# Altium schematic sheet UKU100.SchDoc
size A3
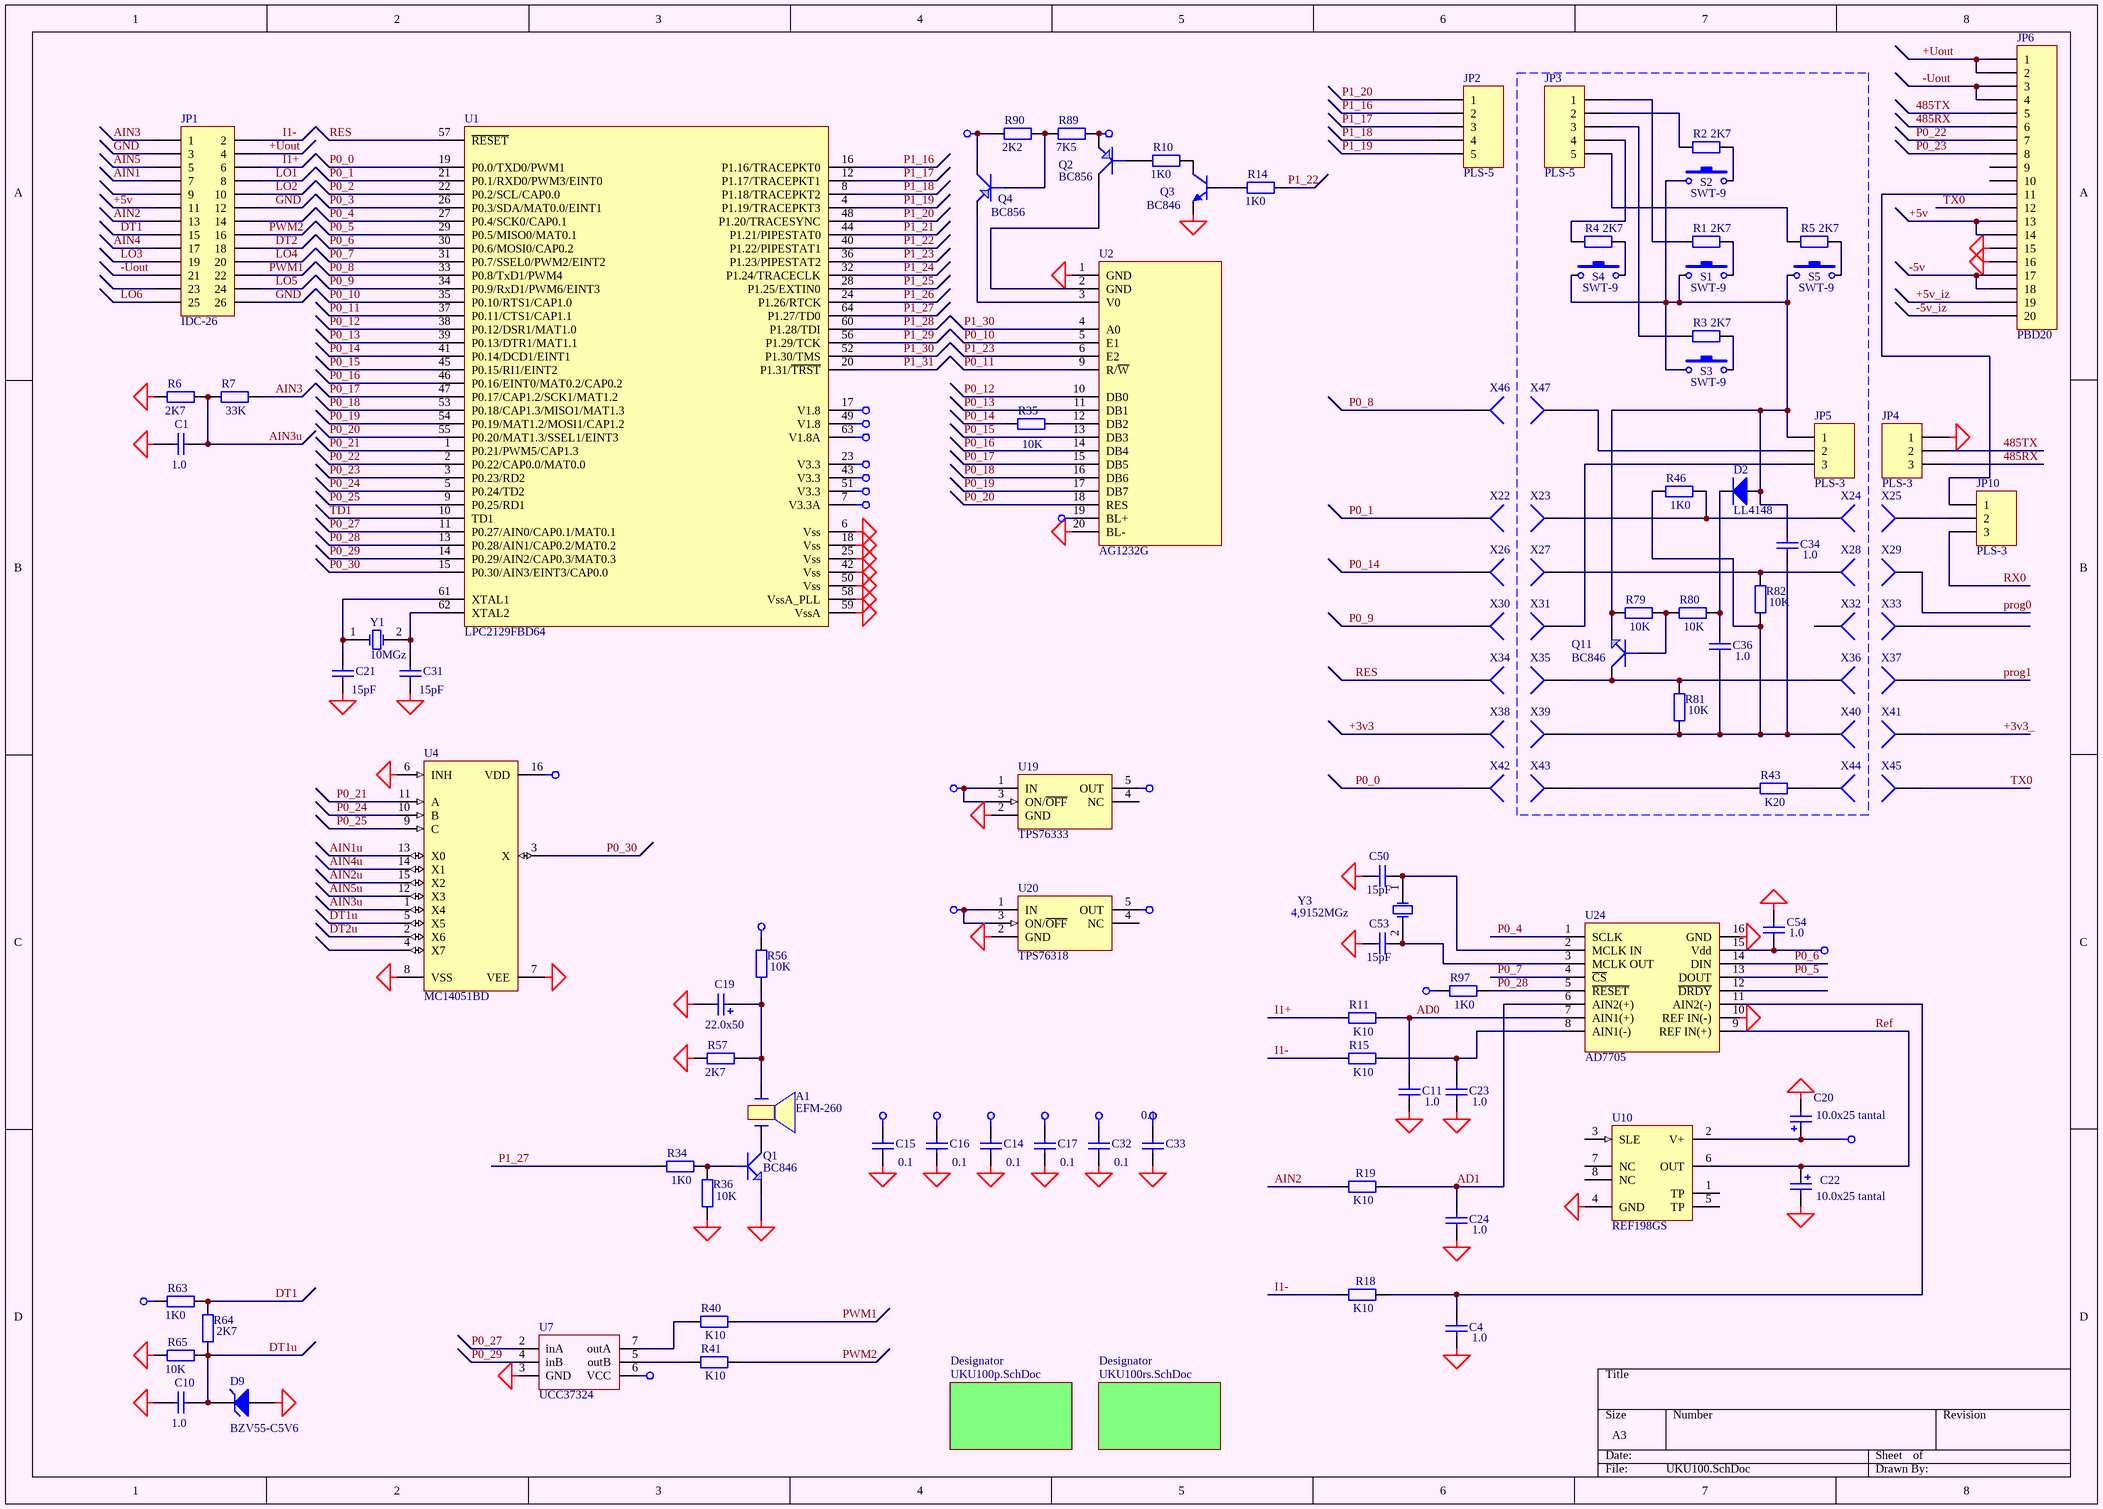
[diagram p0: UKU100.SchDoc]

## Parts
A1  EFM-260  [Pjezo15]
C1  1.0  [C3216-1206]
C4  1.0  [_1206]
C10  1.0  [C3216-1206]
C11  1.0  [C3216-1206]
C14  0.1  [C3216-1206]
C15  0.1  [C3216-1206]
C16  0.1  [C3216-1206]
C17  0.1  [C3216-1206]
C19  22.0x50  [el3]
C20  10.0x25 tantal  [cap_el_6_3]
C21  15pF  [C3216-1206]
C22  10.0x25 tantal  [cap_el_6_3]
C23  1.0  [C3216-1206]
C24  1.0  [C3216-1206]
C31  15pF  [C3216-1206]
C32  0.1  [C3216-1206]
C33  0.1  [C3216-1206]
C34  1.0  [C3216-1206]
C36  1.0  [C3216-1206]
C50  15pF  [_1206]
C53  15pF  [_1206]
C54  1.0  [C3216-1206]
D2  LL4148  [_1206d]
D9  BZV55-C5V6  [_1206d]
JP1  IDC-26  [SCM-26]
JP2  PLS-5  [HDR1X5]
JP3  PLS-5  [HDR1X5]
JP4  PLS-3  [HDR1X3]
JP5  PLS-3  [HDR1X3]
JP6  PBD20  [HDR2X10]
JP10  PLS-3  [HDR1X3]
Q1  BC846  [SO-G3]
Q2  BC856  [SO-G3]
Q3  BC846  [SO-G3]
Q4  BC856  [SO-G3]
Q11  BC846  [SO-G3]
R1  2K7  [_1206]
R2  2K7  [_1206]
R3  2K7  [_1206]
R4  2K7  [_1206]
R5  2K7  [_1206]
R6  2K7  [_1206]
R7  33K  [_1206]
R10  1K0  [_1206]
R11  K10  [_1206]
R14  1K0  [_1206]
R15  K10  [_1206]
R18  K10  [_1206]
R19  K10  [_1206]
R34  1K0  [_1206]
R35  10K  [_1206]
R36  10K  [_1206]
R40  K10  [_1206]
R41  K10  [_1206]
R43  K20  [_1206]
R46  1K0  [_1206]
R56  10K  [_1206]
R57  2K7  [_1206]
R63  1K0  [_1206]
R64  2K7  [_1206]
R65  10K  [_1206]
R79  10K  [_1206]
R80  10K  [_1206]
R81  10K  [_1206]
R82  10K  [_1206]
R89  7K5  [_1206]
R90  2K2  [_1206]
R97  1K0  [_1206]
S1  SWT-9  [SWT-9]
S2  SWT-9  [SWT-9]
S3  SWT-9  [SWT-9]
S4  SWT-9  [SWT-9]
S5  SWT-9  [SWT-9]
U1  LPC2129FBD64  [F-QFP10X10-G64/P.5N]
U2  AG1232G  [AG1232G]
U4  MC14051BD  [SO-G16/C5.85]
U7  UCC37324  [SO-G8]
U10  REF198GS  [SO-G8]
U19  TPS76333  [SO-G5/P.95]
U20  TPS76318  [SO-G5/P.95]
U24  AD7705  [SO-G16/D10.4]
X22  (no value)  [PIN1]
X23  (no value)  [PIN1]
X24  (no value)  [PIN1]
X25  (no value)  [PIN1]
X26  (no value)  [PIN1]
X27  (no value)  [PIN1]
X28  (no value)  [PIN1]
X29  (no value)  [PIN1]
X30  (no value)  [PIN1]
X31  (no value)  [PIN1]
X32  (no value)  [PIN1]
X33  (no value)  [PIN1]
X34  (no value)  [PIN1]
X35  (no value)  [PIN1]
X36  (no value)  [PIN1]
X37  (no value)  [PIN1]
X38  (no value)  [PIN1]
X39  (no value)  [PIN1]
X40  (no value)  [PIN1]
X41  (no value)  [PIN1]
X42  (no value)  [PIN1]
X43  (no value)  [PIN1]
X44  (no value)  [PIN1]
X45  (no value)  [PIN1]
X46  (no value)  [PIN1]
X47  (no value)  [PIN1]
Y1  10MGz  [QWARZ1]
Y3  4,9152MGz  [QWARZ1]

## Sub-sheets
Designator = UKU100p.SchDoc: no entries
Designator = UKU100rs.SchDoc: no entries

## Nets
+1v8: C14.2 C32.2 U1.17(V1.8) U1.49(V1.8) U1.63(V1.8A) U20.5(OUT)
+3v3: C33.2 U1.7(V3.3A) U1.23(V3.3) U1.43(V3.3) U1.51(V3.3) X38.1
+3v3_: C17.2 U19.5(OUT) X41.1
+5v: C15.2 C20.1 C54.2 JP1.11 JP6.13 JP6.14 Q2.2(E) R63.2 R89.2 R97.2 U2.19(BL+) U4.16(VDD) U7.6(VCC) U10.2(V+) U19.1(IN) U19.3(ON/~{OFF}) U20.1(IN) U20.3(ON/~{OFF}) U24.15(Vdd)
+Uout: JP1.4 JP6.1 JP6.2 R56.2
-5v: C16.2 JP6.17 JP6.18 Q4.3(C) R90.1
GND: C1.2 C4.1 C10.2 C11.1 C14.1 C15.1 C16.1 C17.1 C19.2 C20.2 C21.1 C22.2 C23.1 C24.1 C31.1 C32.1 C33.1 C50.1 C53.1 C54.1 D9.1(A) JP1.3 JP1.12 JP1.26 JP4.1 JP6.15 JP6.16 Q1.2(E) Q3.2(E) R6.2 R36.1 R57.1 R65.1 U1.6(Vss) U1.18(Vss) U1.25(Vss) U1.42(Vss) U1.50(Vss) U1.58(VssA_PLL) U1.59(VssA) U2.1(GND) U2.20(BL-) U4.6(INH) U4.7(VEE) U4.8(VSS) U7.3(GND) U10.4(GND) U19.2(GND) U20.2(GND) U24.10(REF_IN(-)) U24.16(GND)
485RX: JP4.3 JP6.6
485TX: JP4.2 JP6.5
+5v_iz: JP6.19
-5v_iz: JP6.20
-Uout: JP1.21 JP6.3 JP6.4
AD0: C11.2 R11.1 U24.7(AIN1(+))
AD1: C24.2 R19.1 U24.6(AIN2(+))
AIN1: JP1.7
AIN1u: U4.13(X0)
AIN2: JP1.13 R19.2
AIN2u: U4.15(X2)
AIN3: JP1.1 R7.2
AIN3u: C1.1 R6.1 R7.1 U4.1(X4)
AIN4: JP1.17
AIN4u: U4.14(X1)
AIN5: JP1.5
AIN5u: U4.12(X3)
DT1: JP1.15 R63.1 R64.1
DT1u: C10.1 D9.2(K) R64.2 R65.2 U4.5(X5)
DT2: JP1.18
DT2u: U4.2(X6)
I1+: JP1.6 R11.2
I1-: JP1.2 R15.2 R18.2
LO1: JP1.8
LO2: JP1.10
LO3: JP1.19
LO4: JP1.20
LO5: JP1.24
LO6: JP1.25
P0_0: U1.19(P0.0/TXD0/PWM1) X42.1
P0_1: U1.21(P0.1/RXD0/PWM3/EINT0) X22.1
P0_2: U1.22(P0.2/SCL/CAP0.0)
P0_3: U1.26(P0.3/SDA/MAT0.0/EINT1)
P0_4: U1.27(P0.4/SCK0/CAP0.1) U24.1(SCLK)
P0_5: U1.29(P0.5/MISO0/MAT0.1) U24.13(DOUT)
P0_6: U1.30(P0.6/MOSI0/CAP0.2) U24.14(DIN)
P0_7: U1.31(P0.7/SSEL0/PWM2/EINT2) U24.4(~{CS})
P0_8: U1.33(P0.8/TxD1/PWM4) X46.1
P0_9: U1.34(P0.9/RxD1/PWM6/EINT3) X30.1
P0_10: U1.35(P0.10/RTS1/CAP1.0) U2.5(E1)
P0_11: U1.37(P0.11/CTS1/CAP1.1) U2.9(R/~{W})
P0_12: U1.38(P0.12/DSR1/MAT1.0) U2.10(DB0)
P0_13: U1.39(P0.13/DTR1/MAT1.1) U2.11(DB1)
P0_14: R35.1 U1.41(P0.14/DCD1/EINT1) X26.1
P0_15: U1.45(P0.15/RI1/EINT2) U2.13(DB3)
P0_16: U1.46(P0.16/EINT0/MAT0.2/CAP0.2) U2.14(DB4)
P0_17: U1.47(P0.17/CAP1.2/SCK1/MAT1.2) U2.15(DB5)
P0_18: U1.53(P0.18/CAP1.3/MISO1/MAT1.3) U2.16(DB6)
P0_19: U1.54(P0.19/MAT1.2/MOSI1/CAP1.2) U2.17(DB7)
P0_20: U1.55(P0.20/MAT1.3/SSEL1/EINT3) U2.18(RES)
P0_21: U1.1(P0.21/PWM5/CAP1.3) U4.11(A)
P0_22: JP6.7 U1.2(P0.22/CAP0.0/MAT0.0)
P0_23: JP6.8 U1.3(P0.23/RD2)
P0_24: U1.5(P0.24/TD2) U4.10(B)
P0_25: U1.9(P0.25/RD1) U4.9(C)
P0_27: U1.11(P0.27/AIN0/CAP0.1/MAT0.1) U7.2(inA)
P0_28: R97.1 U1.13(P0.28/AIN1/CAP0.2/MAT0.2) U24.5(~{RESET})
P0_29: U1.14(P0.29/AIN2/CAP0.3/MAT0.3) U7.4(inB)
P0_30: U1.15(P0.30/AIN3/EINT3/CAP0.0) U4.3(X)
P1_16: JP2.2 U1.16(P1.16/TRACEPKT0)
P1_17: JP2.3 U1.12(P1.17/TRACEPKT1)
P1_18: JP2.4 U1.8(P1.18/TRACEPKT2)
P1_19: JP2.5 U1.4(P1.19/TRACEPKT3)
P1_20: JP2.1 U1.48(P1.20/TRACESYNC)
P1_21: U1.44(P1.21/PIPESTAT0)
P1_22: R14.1 U1.40(P1.22/PIPESTAT1)
P1_23: U1.36(P1.23/PIPESTAT2) U2.6(E2)
P1_24: U1.32(P1.24/TRACECLK)
P1_25: U1.28(P1.25/EXTIN0)
P1_26: U1.24(P1.26/RTCK)
P1_27: R34.1 U1.64(P1.27/TD0)
P1_28: U1.60(P1.28/TDI)
P1_29: U1.56(P1.29/TCK)
P1_30: U1.52(P1.30/TMS) U2.4(A0)
P1_31: U1.20(P1.31/~{TRST})
prog0: X29.1
prog1: X37.1
PWM1: JP1.22 R40.1
PWM2: JP1.16 R41.1
Ref: C22.1 U10.6(OUT) U24.9(REF_IN(+))
RES: U1.57(~{RESET}) X34.1
RX0: JP10.3
TD1: U1.10(TD1)
TX0: JP6.12 X45.1
NetA1_1: A1.1 Q1.3(C)
NetA1_2: A1.2 C19.1 R56.1 R57.2
NetC4_2: C4.2 R18.1 U24.11(AIN2(-))
NetC21_2: C21.2 U1.61(XTAL1) Y1.1(OSC1)
NetC23_2: C23.2 R15.1 U24.8(AIN1(-))
NetC31_2: C31.2 U1.62(XTAL2) Y1.2(OSC2)
NetC34_1: C34.1 D2.1(A) JP5.1 Q11.2(E) R79.1 S1.1 S2.1 S3.1 S4.1 S5.1
NetC34_2: C34.2 C36.2 R46.2 R81.1 R82.1 X39.1 X40.1
NetC36_1: C36.1 D2.2(K) R80.2
NetC50_2: C50.2 U24.2(MCLK_IN) Y3.1(OSC1)
NetC53_2: C53.2 U24.3(MCLK_OUT) Y3.2(OSC2)
NetJP3_1: JP3.1 R1.2
NetJP3_2: JP3.2 R2.2
NetJP3_3: JP3.3 R3.2
NetJP3_4: JP3.4 R4.2
NetJP3_5: JP3.5 R5.2
NetJP5_2: JP5.2 X47.1
NetJP5_3: JP5.3 X31.1
NetJP6_11: JP6.11 JP10.1
NetJP10_2: JP10.2 X25.1
NetQ1_1: Q1.1(B) R34.2 R36.2
NetQ2_1: Q2.1(B) R10.2
NetQ2_3: Q2.3(C) U2.2(GND)
NetQ3_1: Q3.1(B) R14.2
NetQ3_3: Q3.3(C) R10.1
NetQ4_1: Q4.1(B) R89.1 R90.2
NetQ4_2: Q4.2(E) U2.3(V0)
NetQ11_1: Q11.1(B) R79.2 R80.1
NetQ11_3: Q11.3(C) R81.2 X35.1 X36.1
NetR1_1: R1.1 S1.2
NetR2_1: R2.1 S2.2
NetR3_1: R3.1 S3.2
NetR4_1: R4.1 S4.2
NetR5_1: R5.1 S5.2
NetR35_2: R35.2 U2.12(DB2)
NetR40_2: R40.2 U7.7(outA)
NetR41_2: R41.2 U7.5(outB)
NetR43_1: R43.1 X43.1
NetR43_2: R43.2 X44.1
NetR46_1: R46.1 X23.1 X24.1
NetR82_2: R82.2 X27.1 X28.1

Not connected (* = marked no-connect by the designer): JP1 9 14 23; JP6 9 10; U4 4(X7); U10 1(TP) 3(SLE) 5(TP) 7(NC) 8(NC); U19 4(NC); U20 4(NC); U24 12(~{DRDY}); X32 1; X33 1

## Library data of the parts
A1 = PJEZ0
C1 C4 C10 C11 C23 C24 C34 C36 = Cap Semi: Capacitor (Semiconductor SIM Model); Manufacturer: Generic Components; Class I: Passive; Value: 1,0; Published: 8-Jun-2000; Revision: July-2002: Re-released for DXP Platform.; Publisher: Altium Limited; Class II: Capacitor
C14-C17 C32 C33 = Cap Semi: Capacitor (Semiconductor SIM Model); Manufacturer: Generic Components; Class I: Passive; Value: 0,1; Published: 8-Jun-2000; Revision: July-2002: Re-released for DXP Platform.; Publisher: Altium Limited; Class II: Capacitor
C19 = Cap Pol1: Polarized Capacitor (Radial); Manufacturer: Generic Components; Class I: Passive; Value: 22,0; Published: 8-Jun-2000; Revision: July-2002: Re-released for DXP Platform.; Publisher: Altium Limited; Class II: Capacitor
C20 C22 = Cap Pol3: Polarized Capacitor (Surface Mount); Manufacturer: Generic Components; Class I: Passive; Value: 10,0; Published: 8-Jun-2000; Revision: July-2002: Re-released for DXP Platform.; Publisher: Altium Limited; Class II: Capacitor
C21 C31 = Cap Semi: Capacitor (Semiconductor SIM Model); Manufacturer: Generic Components; Class I: Passive; Published: 8-Jun-2000; Revision: July-2002: Re-released for DXP Platform.; Publisher: Altium Limited; Class II: Capacitor; Value: 15pF
C50 C53 = Cap Semi: Capacitor; Manufacturer: Generic Components; Class I: Passive; Published: 8-Jun-2000; Revision: July-2002: Re-released for DXP Platform.; Publisher: Altium Limited; Class II: Capacitor; Value: 15pF
C54 = Cap Semi: Capacitor; Manufacturer: Generic Components; Class I: Passive; Value: 1,0; Published: 8-Jun-2000; Revision: July-2002: Re-released for DXP Platform.; Publisher: Altium Limited; Class II: Capacitor
D2 = Diode: Default Diode; Manufacturer: Generic Components; Class I: Discrete; Class II: Diode - Switching; Published: 8-Jun-2000; Revision: July-2002: Re-released for DXP Platform.; Publisher: Altium Limited
D9 = D Zener: Zener Diode; Manufacturer: Generic Components; Class I: Discrete; Class II: Diode - Zener; Published: 8-Jun-2000; Revision: July-2002: Re-released for DXP Platform.; Publisher: Altium Limited
JP1 = MHDR2X13: Header, 13-Pin, Dual row; Manufacturer: Generic Components; Class I: Connector; Revision: July-2002: Re-released for DXP Platform.; Publisher: Altium Limited
JP2 JP3 = Header 5: Header, 5-Pin; Manufacturer: Generic Components; Class I: Connector; Revision: July-2002: Re-released for DXP Platform.; Publisher: Altium Limited
JP4 JP5 JP10 = Header 3: Header, 3-Pin; Manufacturer: Generic Components; Class I: Connector; Revision: July-2002: Re-released for DXP Platform.; Publisher: Altium Limited
JP6 = Header 20: Header, 20-Pin; Manufacturer: Generic Components; Class I: Connector; Revision: July-2002: Re-released for DXP Platform.; Publisher: Altium Limited
Q1 Q11 = GT122: Right: 20; Bottom: 20
Q2 Q4 = GT109: Right: 20; Bottom: 20
Q3 = BC847ALT1: General Purpose Transistor NPN Silicon; Manufacturer: Motorola; Package Information: Latest Revision: 1997; Class I: Discrete; Class II: BJT - Low Power; Published: 29-Sep-2000; Revision: July-2002: Re-released for DXP Platform.; Datasheet: Latest Revision: 1997; Package Reference: 318-08; Publisher: Altium Limited
R1-R5 R7 R10 R14 R34 R35 R40 R41 R46 R56 R57 R63-R65 R79-R82 R89 R90 = Res2: Resistor; Manufacturer: Generic Components; Class I: Passive; Rule: Undefined; Published: 8-Jun-2000; Revision: July-2002: Re-released for DXP Platform.; Publisher: Altium Limited; Class II: Resistor
  R1-R5 R57 R64: Value: 2K7
  R10 R14 R34 R46 R63: Value: 1K0
  R35 R56 R65 R79-R82: Value: 10K
  R40 R41: Value: K10
  R89: Value: 7K5
  R90: Value: 2K2
R6 = Res2: Resistor; Manufacturer: Generic Components; Class I: Passive; Value: 1K; Rule: Undefined; Published: 8-Jun-2000; Revision: July-2002: Re-released for DXP Platform.; Publisher: Altium Limited; Class II: Resistor
R11 R15 R18 R19 = Res2: Resistor; Manufacturer: Generic Components; Class I: Passive; Value: 100R; Published: 8-Jun-2000; Revision: July-2002: Re-released for DXP Platform.; Publisher: Altium Limited; Class II: Resistor
R36 = Res2: Resistor; Manufacturer: Generic Components; Class I: Passive; Published: 8-Jun-2000; Revision: July-2002: Re-released for DXP Platform.; Publisher: Altium Limited; Class II: Resistor; Value: 10K
R43 = Res2: Resistor; Manufacturer: Generic Components; Class I: Passive; Value: 200R; Rule: Undefined; Published: 8-Jun-2000; Revision: July-2002: Re-released for DXP Platform.; Publisher: Altium Limited; Class II: Resistor
R97 = Res2: Resistor; Manufacturer: Generic Components; Class I: Passive; Value: 1K; Published: 8-Jun-2000; Revision: July-2002: Re-released for DXP Platform.; Publisher: Altium Limited; Class II: Resistor
S1-S5 = SWT-9: Switch; Manufacturer: Generic Components; Published: 24-Mar-1999; Revision: July-2002: Re-released for DXP Platform.; Publisher: Altium Limited
U4 = MC14051BD: 8-Channel Analog Multiplexer/Demultiplexer; Manufacturer: ON Semiconductor; Class I: Logic; Class II: Multiplexer/Encoder/Selector; Published: 15-Apr-2002; Package Reference: 751B-05; Publisher: Altium Limited
U10 = REF198GS: Precision Micropower, Low-Dropout, Voltage Reference; Manufacturer: Analog Devices; Revision 1: 10-July-2000: SIM Model Added.; Revision 2: July-2002: Re-released for DXP Platform.; Class I: Power Management; Note: Pins 7 and 8 are not connected; Pins 1 and 5 are factory test only, make no electrical connection; Published: 8-Jun-2000; Datasheet: Designer's Reference Manual CD (REV. C); Package Reference: SO-8B; Publisher: Altium Limited; Class II: Voltage Reference
U19 U20 = LP2980AIM5-3.3: Micropower SOT, 50 mA Ultra Low-Dropout Regulator; Manufacturer: National Semiconductor; Package Information: Latest Revision: Aug-1999; Class I: Power Management; Class II: Voltage Regulator; Published: 15-Apr-2002; Datasheet: Latest Revision: Oct-1999; Package Reference: MA05B; Publisher: Altium Limited
U24 = AD7705: ADC; Value: AD7705
X22-X47 = Socket: Manufacturer: Generic Components; Class I: Connector; Revision: July-2002: Re-released for DXP Platform.; Publisher: Altium Limited
Y1 Y3 = XTAL: Crystal Oscillator; Manufacturer: Generic Components; Published: 8-Jun-2000; Revision: July-2002: Re-released for DXP Platform.; Publisher: Altium Limited; Class I: Oscillator; Class II: Crystal Oscillator
  Y3: Value: 4,9152MGz